# Altium schematic sheet ADAPTADOR.SchDoc
size A4; SheetNumber: 1; SheetTotal: 1
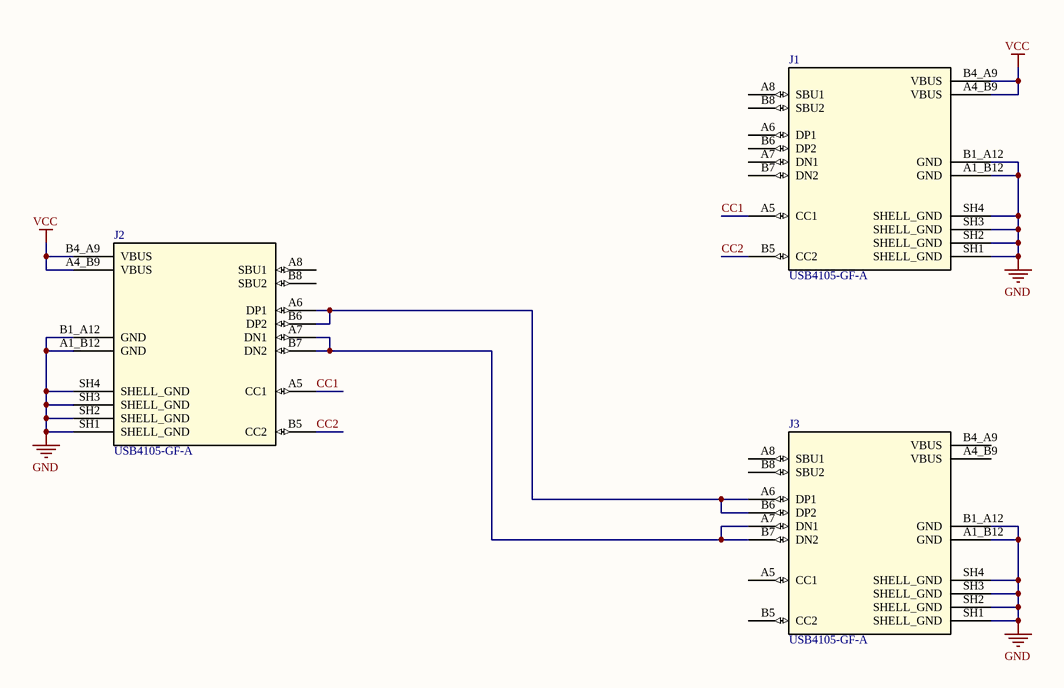
[diagram p0: ADAPTADOR.SchDoc]

## Parts
J1  PN: USB4105-GF-A  [GCT_USB4105-GF-A]  (hidden comment: CONN RCP USB2.0 TYP C 24P SMD RA)
J2  PN: USB4105-GF-A  [GCT_USB4105-GF-A]  (hidden comment: CONN RCP USB2.0 TYP C 24P SMD RA)
J3  PN: USB4105-GF-A  [GCT_USB4105-GF-A]  (hidden comment: CONN RCP USB2.0 TYP C 24P SMD RA)

## Nets
GND: J1.A1_B12(GND) J1.B1_A12(GND) J1.SH1(SHELL_GND) J1.SH2(SHELL_GND) J1.SH3(SHELL_GND) J1.SH4(SHELL_GND) J2.A1_B12(GND) J2.B1_A12(GND) J2.SH1(SHELL_GND) J2.SH2(SHELL_GND) J2.SH3(SHELL_GND) J2.SH4(SHELL_GND) J3.A1_B12(GND) J3.B1_A12(GND) J3.SH1(SHELL_GND) J3.SH2(SHELL_GND) J3.SH3(SHELL_GND) J3.SH4(SHELL_GND)
VCC: J1.A4_B9(VBUS) J1.B4_A9(VBUS) J2.A4_B9(VBUS) J2.B4_A9(VBUS)
CC1: J1.A5(CC1) J2.A5(CC1)
CC2: J1.B5(CC2) J2.B5(CC2)
NetJ2_A6: J2.A6(DP1) J2.B6(DP2) J3.A6(DP1) J3.B6(DP2)
NetJ2_A7: J2.A7(DN1) J2.B7(DN2) J3.A7(DN1) J3.B7(DN2)

Not connected (* = marked no-connect by the designer): J1 A6(DP1) A7(DN1) A8(SBU1) B6(DP2) B7(DN2) B8(SBU2); J2 A8(SBU1) B8(SBU2); J3 A4_B9(VBUS) A5(CC1) A8(SBU1) B4_A9(VBUS) B5(CC2) B8(SBU2)

## Library data of the parts
J1-J3 = CONN RCP USB2.0 TYP C 24P SMD RA: CONN RCP USB2.0 TYP C 24P SMD RA PN: USB4105-GF-A; MF: {'manufacturer': u'GCT'}; Package: None; Price: None; Availability: Unavailable; Value: *